# EAGLE design USB to USART (EAGLE 6.3)
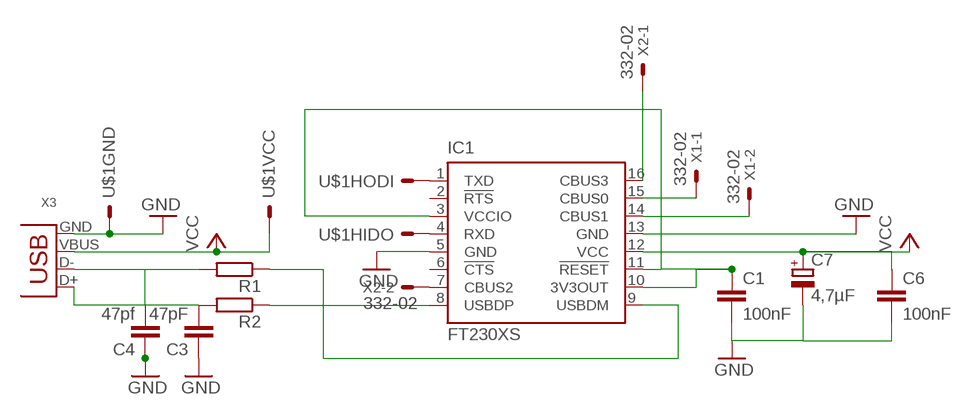
[diagram p0: schematic, sheet 1]

## Parts
C1  100nF  C-EU025-030X050  [C025-030X050]
C3  47pF  C-EU025-030X050  [C025-030X050]
C4  47pf  C-EU025-030X050  [C025-030X050]
C6  100nF  C-EU025-030X050  [C025-030X050]
C7  4,7µF  CPOL-EUB45181B  [B45181B]
IC1  FT230XS  [SSOP16]
R1  R-EU_0204/7  [0204/7]
R2  R-EU_0204/7  [0204/7]
U$1  UARTUSB  [PN61729]
X1  332-02  [332-02]
X2  332-02  [332-02]
X3  USB-B-H  [USB-B-H]

## Nets
GND: C1.2 C3.1 C4.1 C6.2 C7.- IC1.5(GND) IC1.13(GND) U$1.4 X3.GND
N$1: IC1.8(USBDP) R2.1
N$2: C3.2 R2.2 X3.D+
N$3: IC1.9(USBDM) R1.1
N$4: C1.1 IC1.3(VCCIO) IC1.10(3V3OUT) IC1.11(!RESET)
N$5: C4.2 R1.2 X3.D-
N$6: IC1.1(TXD) U$1.3
N$7: IC1.4(RXD) U$1.2
N$9: IC1.14(CBUS1) X1.2
N$10: IC1.15(CBUS0) X1.1
N$11: IC1.16(CBUS3) X2.1
N$12: IC1.7(CBUS2) X2.2
VCC: C6.1 C7.+ IC1.12(VCC) U$1.1 X3.VBUS
Unconnected: IC1.2(!RTS) IC1.6(!CTS)

## Library data of the parts
C1 C3 C4 C6 = rcl:C-EU: CAPACITOR, European symbol
C7 = rcl:CPOL-EU: POLARIZED CAPACITOR, European symbol
IC1 = ftdichip:FT230X: USB to BASIC UART IC Auto generated by make-symbol-device-package-bsdl.ulp Rev. 43 Source: Data sheet <http://www.ftdichip.com/Support/Documents/DataSheets/ICs/DS_FT230X.pdf>
R1 R2 = rcl:R-EU_: RESISTOR, European symbol
U$1 = lieven:UARTUSB
X1 X2 = con-garry:332-02: 2 Pin - 2mm Dual Row Source: www.mpe-connector.de / garry_shortform_2012.pdf
X3 = lieven:USB: USB Connectors

## Board
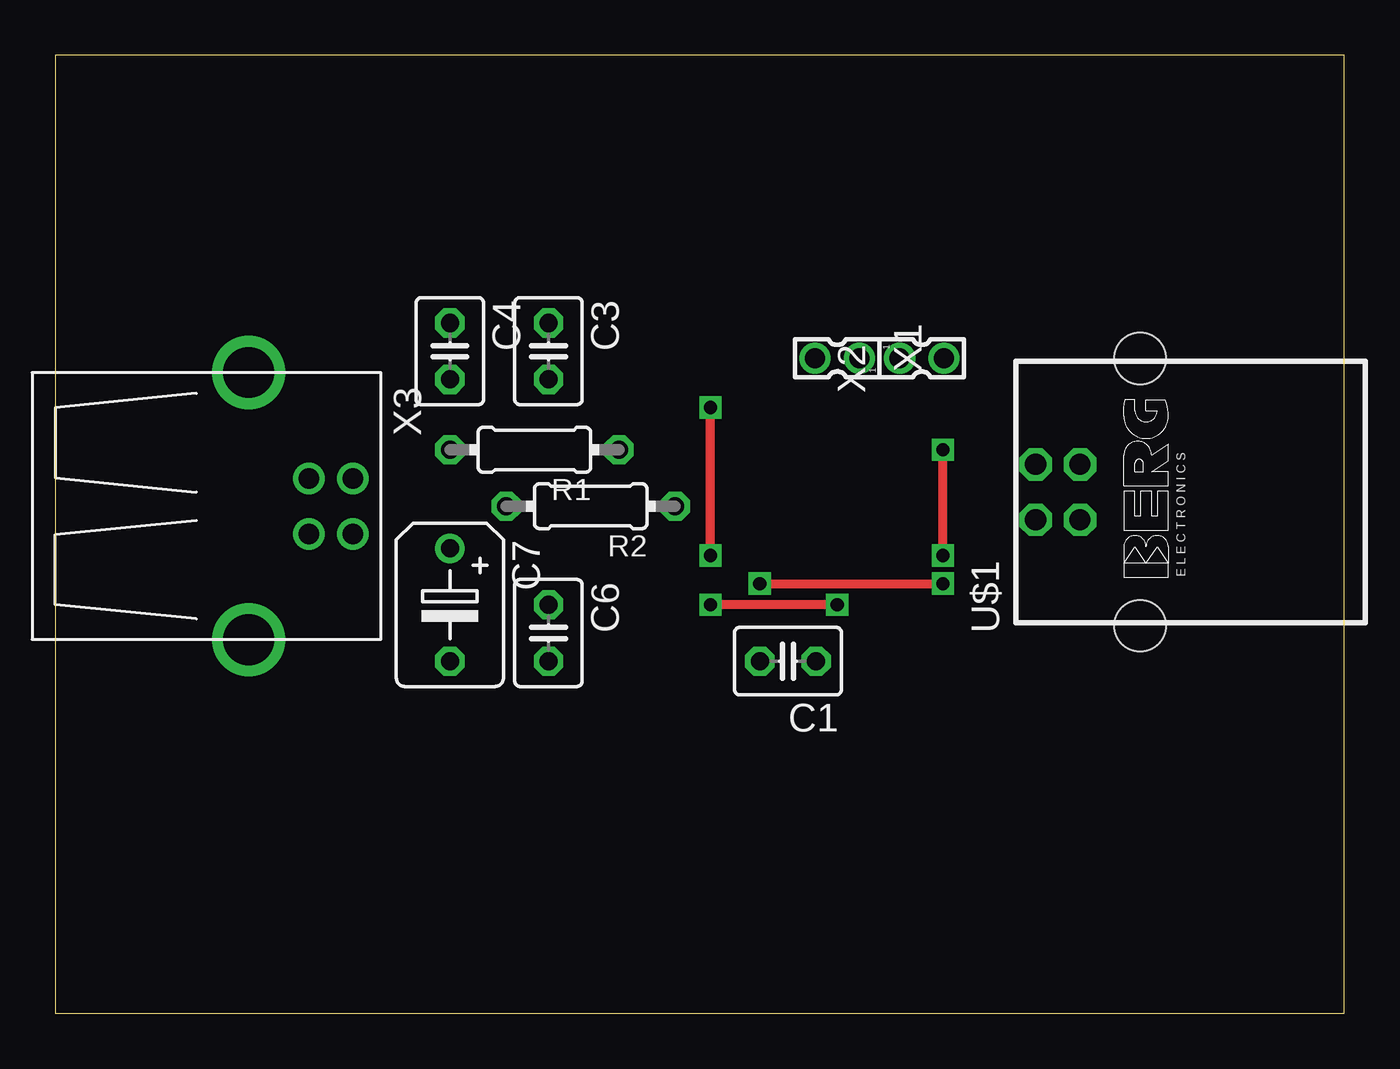
[diagram p1: board, top side]
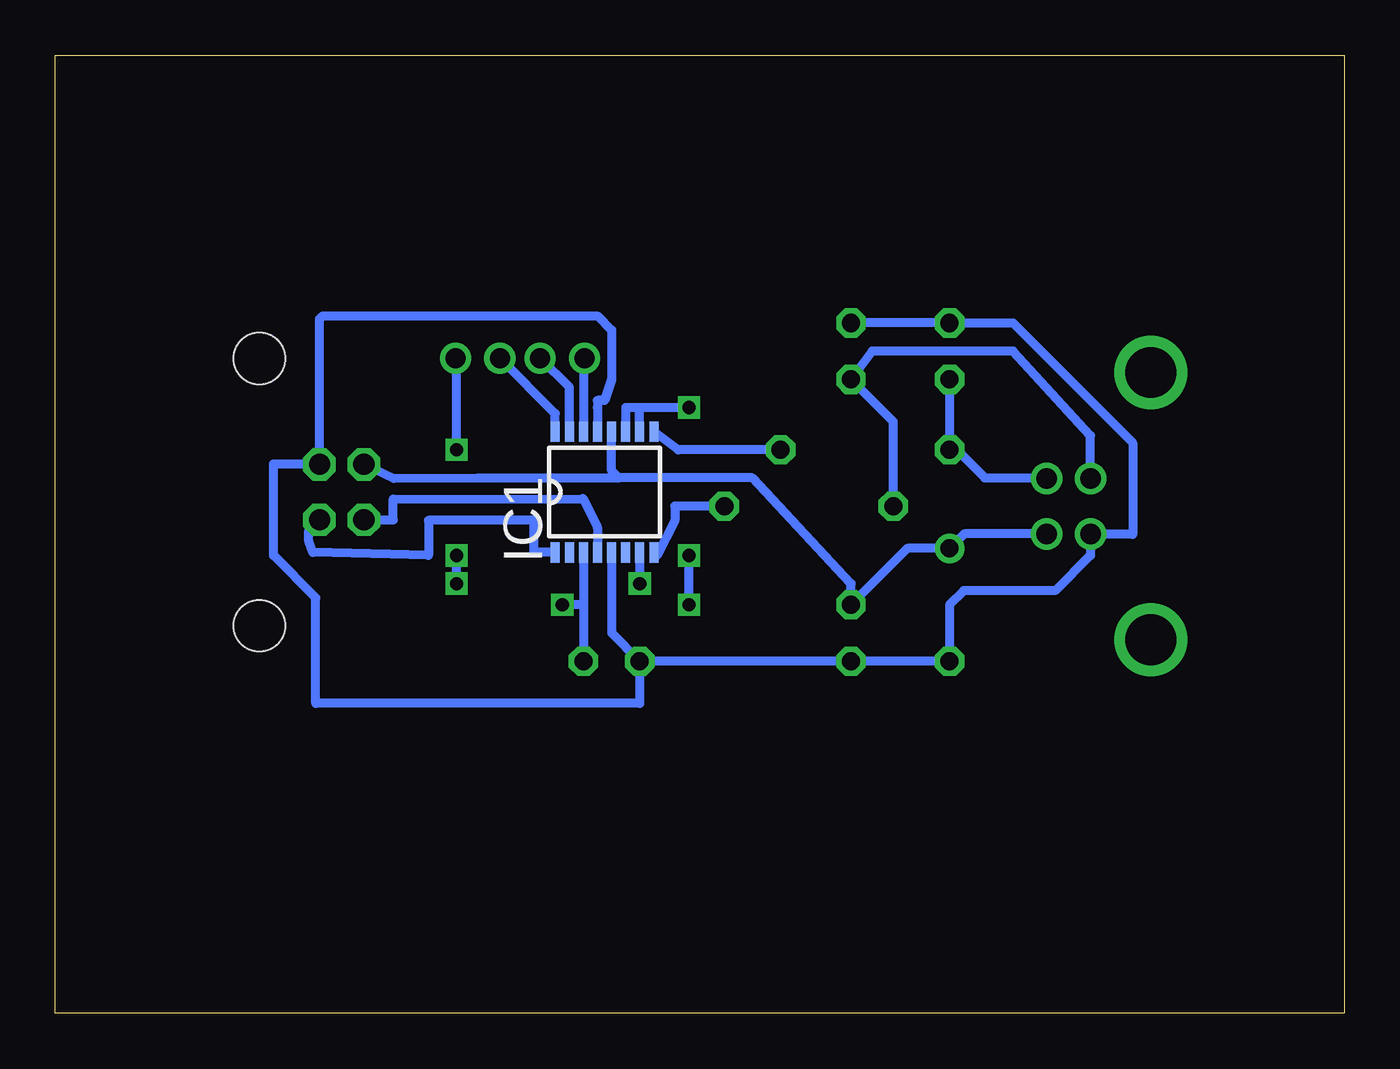
[diagram p2: board, bottom side, seen from below]

Size 58.09 x 43.17 mm. Coordinates in mm from the lower left corner, seen from the top.
Outline: 0,0 58.09,0 58.09,43.17 0,43.17 0,0
Copper layers (1*16): Top 0.035mm / dielectric 1.5mm / Bottom 0.035mm
Design rules "default": minimum track width 10mil, minimum drill 24mil, track to track 8mil, track to pad 8mil, pad to pad 8mil, via to via 8mil, smd to smd 8mil, copper to edge 40mil, drill to drill 8mil, minimum pad ring 10mil, minimum via ring 8mil, stop-mask expansion 4mil, vias tented up to drill 0mil, thermal gap 10mil

### Footprints (pad centres in the part's own frame; a part is rotated, then mirrored left to right if it is on the bottom)
C025-030X050 = drill 0.813 octagon: 1 -1.27,0; 2 1.27,0
B45181B = drill 0.813: + -2.54,0 | drill 0.813 octagon: - 2.54,0
SSOP16 = smd 0.914 x 0.406: 1 -2.718,2.223; 2 -2.718,1.587; 3 -2.718,0.953; 4 -2.718,0.318; 5 -2.718,-0.318; 6 -2.718,-0.953; 7 -2.718,-1.587; 8 -2.718,-2.223; 9 2.718,-2.223; 10 2.718,-1.587; 11 2.718,-0.953; 12 2.718,-0.318; 13 2.718,0.318; 14 2.718,0.953; 15 2.718,1.587; 16 2.718,2.223
0204/7 = drill 0.813 octagon: 1 -3.81,0; 2 3.81,0
PN61729 = drill 0.95 octagon: 1 1.25,4.71; 2 -1.25,4.71; 3 -1.25,2.71; 4 1.25,2.71 | hole 2.3: -6.02,0; 6.02,0
332-02 = drill 0.9 pad 1.27: 1 0,-1; 2 0,1
USB-B-H = drill 0.914: D+ 0,1.25; D- 1.981,1.25; GND 0,-1.25; VBUS 1.981,-1.25 | drill 2.286: P$1 -2.718,-6.02; P$2 -2.718,6.02

### Placement (x,y rotation side)
C1  33.02,15.88 180 top
C3  22.23,29.84 270 top
C4  17.78,29.84 270 top
C6  22.23,17.14 270 top
C7  17.78,18.41 270 top
IC1  33.34,23.5 90 bottom
R1  21.59,25.4 180 top
R2  24.13,22.86 180 top
U$1  48.9,23.5 90 top
X1  35.24,29.53 90 top
X2  39.05,29.53 270 top
X3  11.43,22.86 0 top

### Tracks (layer width: path | path; a pad name or v marks a point on that pad's centre or on a via)
GND
  Bottom 0.406: C3.1 C4.1 14.92,31.11 9.53,25.72 9.53,21.59 11.41,21.59 X3.GND 11.43,20.64 13.02,19.05 17.14,19.05 17.78,18.41 C7.- C6.2 C1.2 | IC1.13 33.66,27.3 33.66,27.62 33.34,27.62 33.02,28.57 33.02,30.8 33.66,31.43 46.04,31.43 46.19,31.29 U$1.4 46.2,24.77 48.26,24.77 48.26,20.64 46.35,18.73 46.35,13.97 31.75,13.97 C1.2 | IC1.5 33.02,17.14 C1.2
N$1
  Bottom 0.406: R2.1 30.16,22.86 30.16,22.23 30.98,20.64 IC1.8
N$2
  Bottom 0.406: R2.2 20.32,26.67 C3.2 21.27,29.84 14.92,29.84 11.43,26.04 X3.D+
N$3
  Bottom 0.406: R1.1 30.02,25.4 IC1.9
N$4  (via drill 0.6)
  Top 0.406: v35.24,18.41 v29.53,18.41 | v29.53,20.64 v29.53,27.3
  Bottom 0.406: 34.29,18.41 C1.1 | IC1.10 31.75,27.3 | 31.75,27.3 32.07,27.3 32.38,27.3 IC1.11 | IC1.3 34.29,18.41 | 34.29,18.41 v35.24,18.41 | v29.53,18.41 v29.53,20.64 | v29.53,27.3 31.75,27.3
N$5
  Bottom 0.406: X3.D- 13.43,24.13 16.19,24.13 17.46,25.4 R1.2 C4.2
N$6
  Bottom 0.406: IC1.1 36.51,20.78 36.51,22.23 41.27,22.23 41.27,20.64 46.49,20.78 46.67,21.27 46.67,21.76 U$1.3
N$7
  Bottom 0.406: U$1.2 42.86,22.25 42.86,23.18 34.31,23.2 33.66,21.91 IC1.4
N$9
  Bottom 0.406: X1.2 34.24,29.57 34.29,29.21 IC1.14
N$10
  Bottom 0.406: IC1.15 34.92,28.21 X1.1
N$11
  Bottom 0.406: IC1.16 35.56,27.04 X2.1
N$12  (via drill 0.6)
  Top 0.406: v31.75,19.37 v40.01,19.37 | v40.01,20.64 v40.01,25.4
  Bottom 0.406: IC1.7 v31.75,19.37 | v40.01,19.37 v40.01,20.64 | v40.01,25.4 40.01,29.48 X2.2
VCC
  Bottom 0.406: X3.VBUS 17.12,21.61 C7.+ 19.68,20.95 C6.1 22.23,19.37 26.67,24.13 32.7,24.13 | 32.7,24.13 33.02,24.45 IC1.12 | U$1.1 42.84,24.11 39.05,24.13 32.7,24.13